# Altium project X98_CARRIER_V1R2.PrjPcb (part 1 of 3)
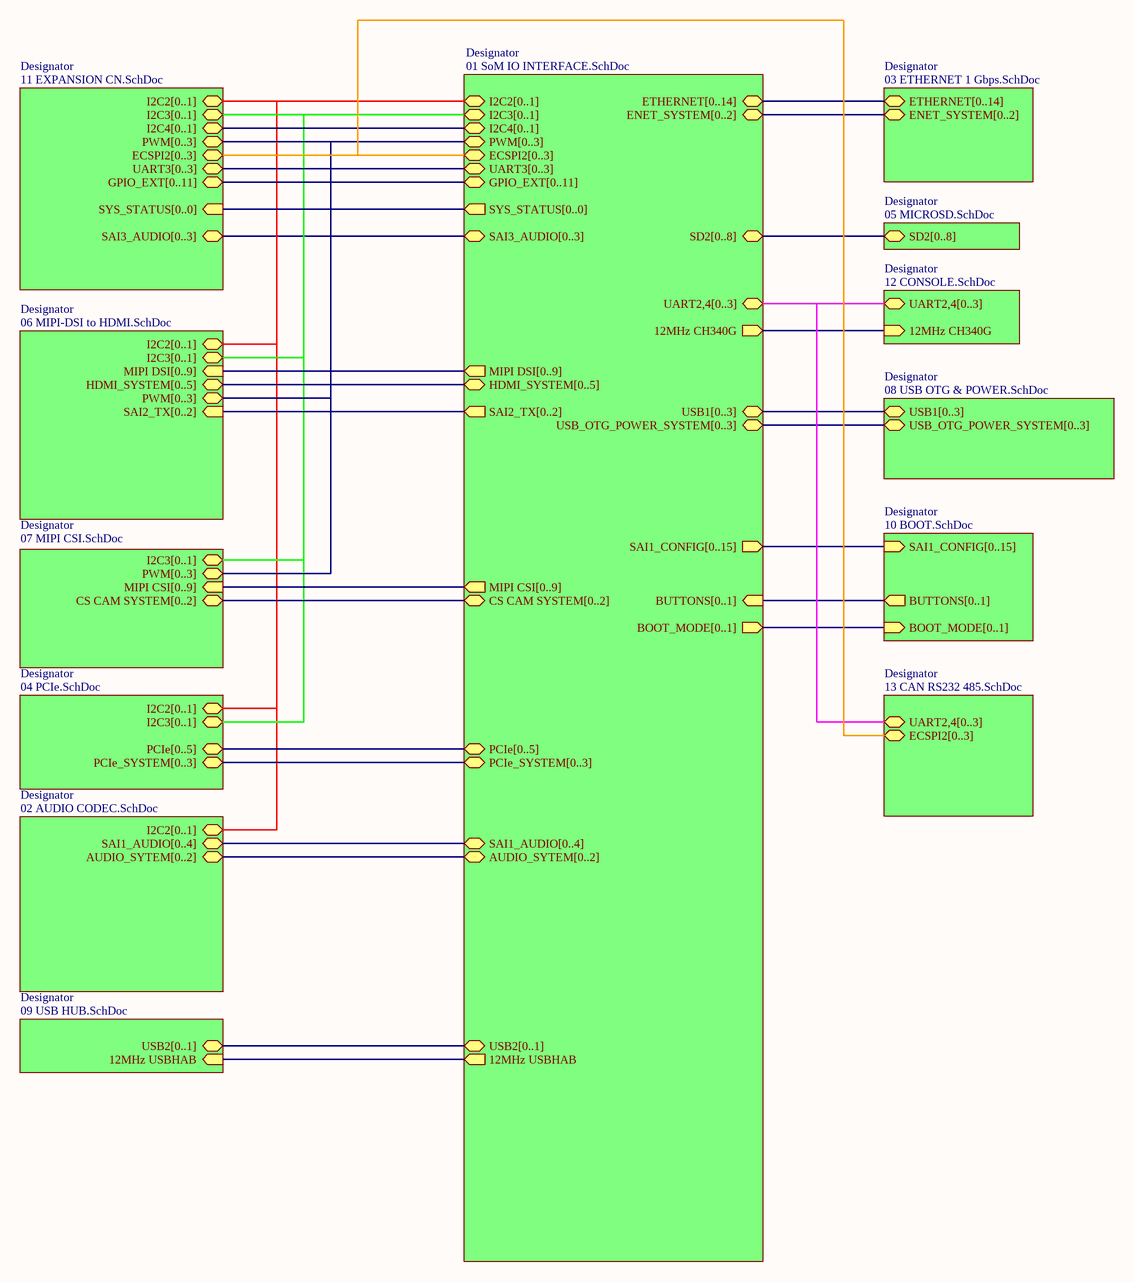
[diagram p0: MAIN.SchDoc]
15 sheets, 356 parts. Net scope: global (net labels, ports and power ports of the same name join across sheets).
Board file: X98_CARRIER_V1R2_12082022.PcbDoc
Sheets:
  MAIN.SchDoc
    Designator = 01 SoM IO INTERFACE.SchDoc
    Designator = 07 MIPI CSI.SchDoc
    Designator = 02 AUDIO CODEC.SchDoc
    Designator = 09 USB HUB.SchDoc
    Designator = 11 EXPANSION CN.SchDoc
    Designator = 04 PCIe.SchDoc
    Designator = 08 USB OTG & POWER.SchDoc
    Designator = 10 BOOT.SchDoc
    Designator = 05 MICROSD.SchDoc
    Designator = 06 MIPI-DSI to HDMI.SchDoc
    Designator = 03 ETHERNET 1 Gbps.SchDoc
    Designator = 12 CONSOLE.SchDoc
    Designator = 13 CAN RS232 485.SchDoc
  00 PCB SPEC.SchDoc

## Sheet MAIN.SchDoc
size A3

### Sub-sheets
Designator = 01 SoM IO INTERFACE.SchDoc: 12MHz USBHAB (out), UART2,4[0..3] (bidir), SD2[0..8] (bidir), ETHERNET[0..14] (bidir), USB2[0..1] (bidir), MIPI DSI[0..9] (out), SAI2_TX[0..2] (out), SAI1_AUDIO[0..4] (bidir), GPIO_EXT[0..11] (bidir), MIPI CSI[0..9] (out), ECSPI2[0..3] (bidir), PCIe_SYSTEM[0..3] (bidir), PCIe[0..5] (bidir), UART3[0..3] (bidir), 12MHz CH340G (out), USB1[0..3] (bidir), SAI1_CONFIG[0..15] (out), AUDIO_SYTEM[0..2] (bidir), HDMI_SYSTEM[0..5] (bidir), CS CAM SYSTEM[0..2] (bidir), ENET_SYSTEM[0..2] (bidir), USB_OTG_POWER_SYSTEM[0..3] (bidir), I2C4[0..1] (bidir), I2C2[0..1] (bidir), I2C3[0..1] (bidir), BUTTONS[0..1] (in), SYS_STATUS[0..0] (out), BOOT_MODE[0..1] (out), SAI3_AUDIO[0..3] (bidir), PWM[0..3] (bidir)
Designator = 07 MIPI CSI.SchDoc: MIPI CSI[0..9] (in), I2C3[0..1] (bidir), CS CAM SYSTEM[0..2] (bidir), PWM[0..3] (bidir)
Designator = 02 AUDIO CODEC.SchDoc: I2C2[0..1] (bidir), SAI1_AUDIO[0..4] (bidir), AUDIO_SYTEM[0..2] (bidir)
Designator = 09 USB HUB.SchDoc: USB2[0..1] (bidir), 12MHz USBHAB (in)
Designator = 11 EXPANSION CN.SchDoc: I2C2[0..1] (bidir), I2C4[0..1] (bidir), I2C3[0..1] (bidir), UART3[0..3] (bidir), GPIO_EXT[0..11] (bidir), ECSPI2[0..3] (bidir), SYS_STATUS[0..0] (in), PWM[0..3] (bidir), SAI3_AUDIO[0..3] (bidir)
Designator = 04 PCIe.SchDoc: PCIe[0..5] (bidir), PCIe_SYSTEM[0..3] (bidir), I2C3[0..1] (bidir), I2C2[0..1] (bidir)
Designator = 08 USB OTG & POWER.SchDoc: USB1[0..3] (bidir), USB_OTG_POWER_SYSTEM[0..3] (bidir)
Designator = 10 BOOT.SchDoc: SAI1_CONFIG[0..15] (in), BUTTONS[0..1] (out), BOOT_MODE[0..1] (in)
Designator = 05 MICROSD.SchDoc: SD2[0..8] (bidir)
Designator = 06 MIPI-DSI to HDMI.SchDoc: SAI2_TX[0..2] (in), I2C3[0..1] (bidir), I2C2[0..1] (bidir), MIPI DSI[0..9] (in), HDMI_SYSTEM[0..5] (bidir), PWM[0..3] (bidir)
Designator = 03 ETHERNET 1 Gbps.SchDoc: ETHERNET[0..14] (bidir), ENET_SYSTEM[0..2] (bidir)
Designator = 12 CONSOLE.SchDoc: 12MHz CH340G (in), UART2,4[0..3] (bidir)
Designator = 13 CAN RS232 485.SchDoc: UART2,4[0..3] (bidir), ECSPI2[0..3] (bidir)

### Nets
(unnamed): sheet Designator/12MHz USBHAB, sheet Designator/12MHz USBHAB
(unnamed): sheet Designator/12MHz CH340G, sheet Designator/12MHz CH340G

### Notes on the sheet
- Sheet Title:
- Inventron
- Size:
- Drawn By:
- Revision:
- Project:
- Checked By:
- A4
- Sheet
- of
- Budotek Teknopark
- Dudullu OSB
- Des 2. Cadde No:8/30
- Umraniye / ISTANBUL
- Electronics and Software
- Date:
- Time:
- ©2020 Inventron Electronics and Software. All rights reserved.

## Sheet 01 SoM IO INTERFACE.SchDoc
size A2
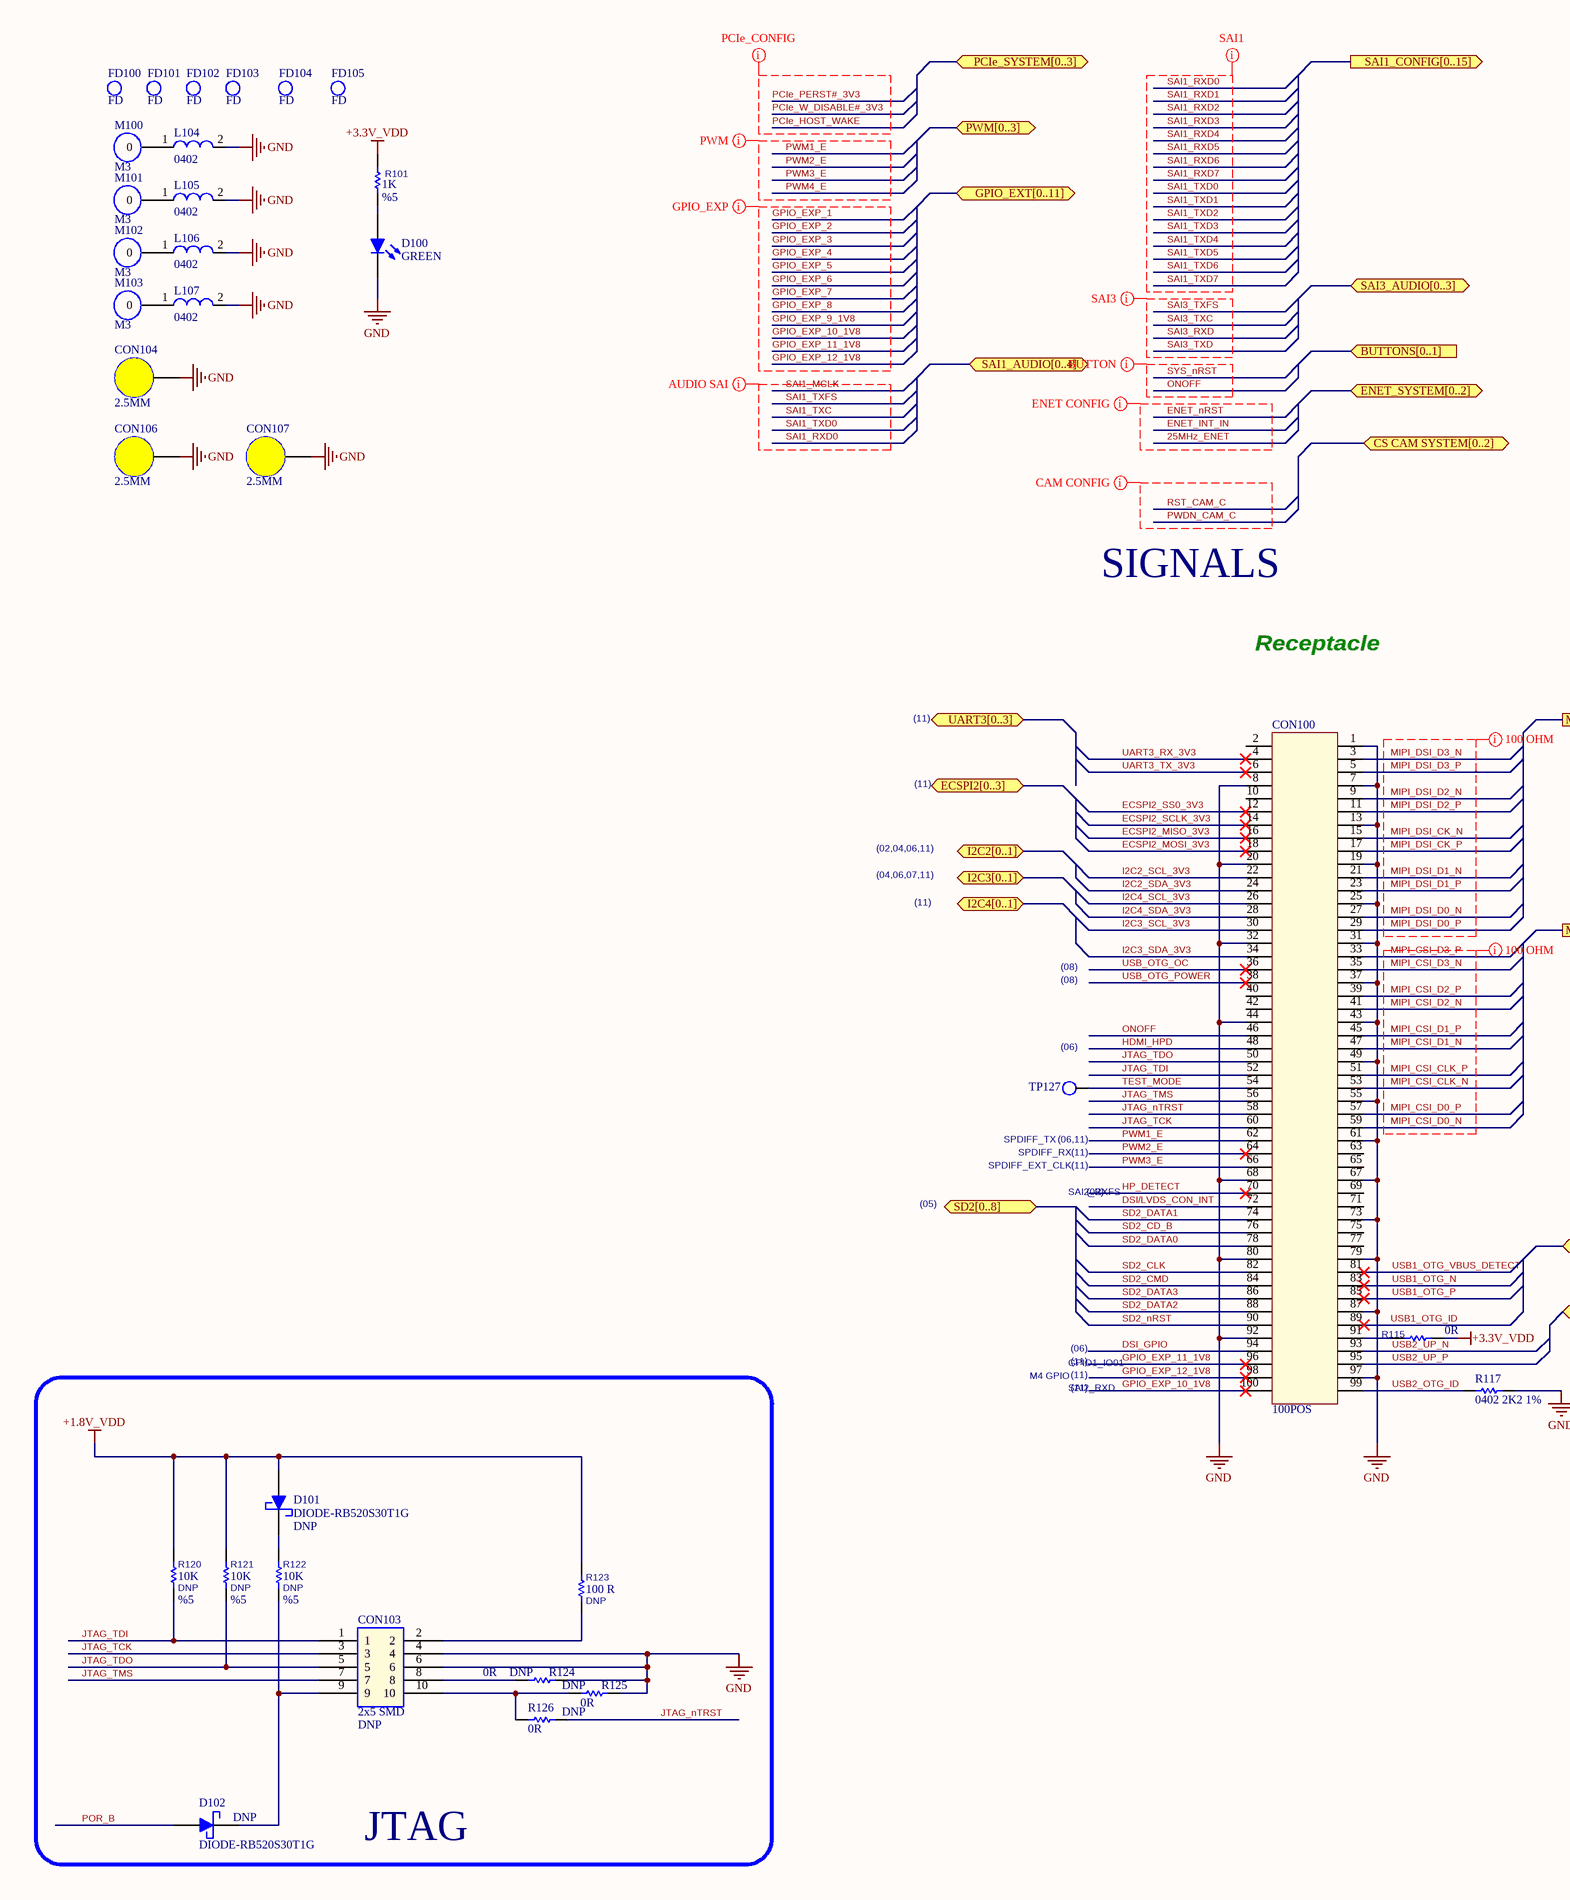
[diagram p1: 01 SoM IO INTERFACE.SchDoc, left]
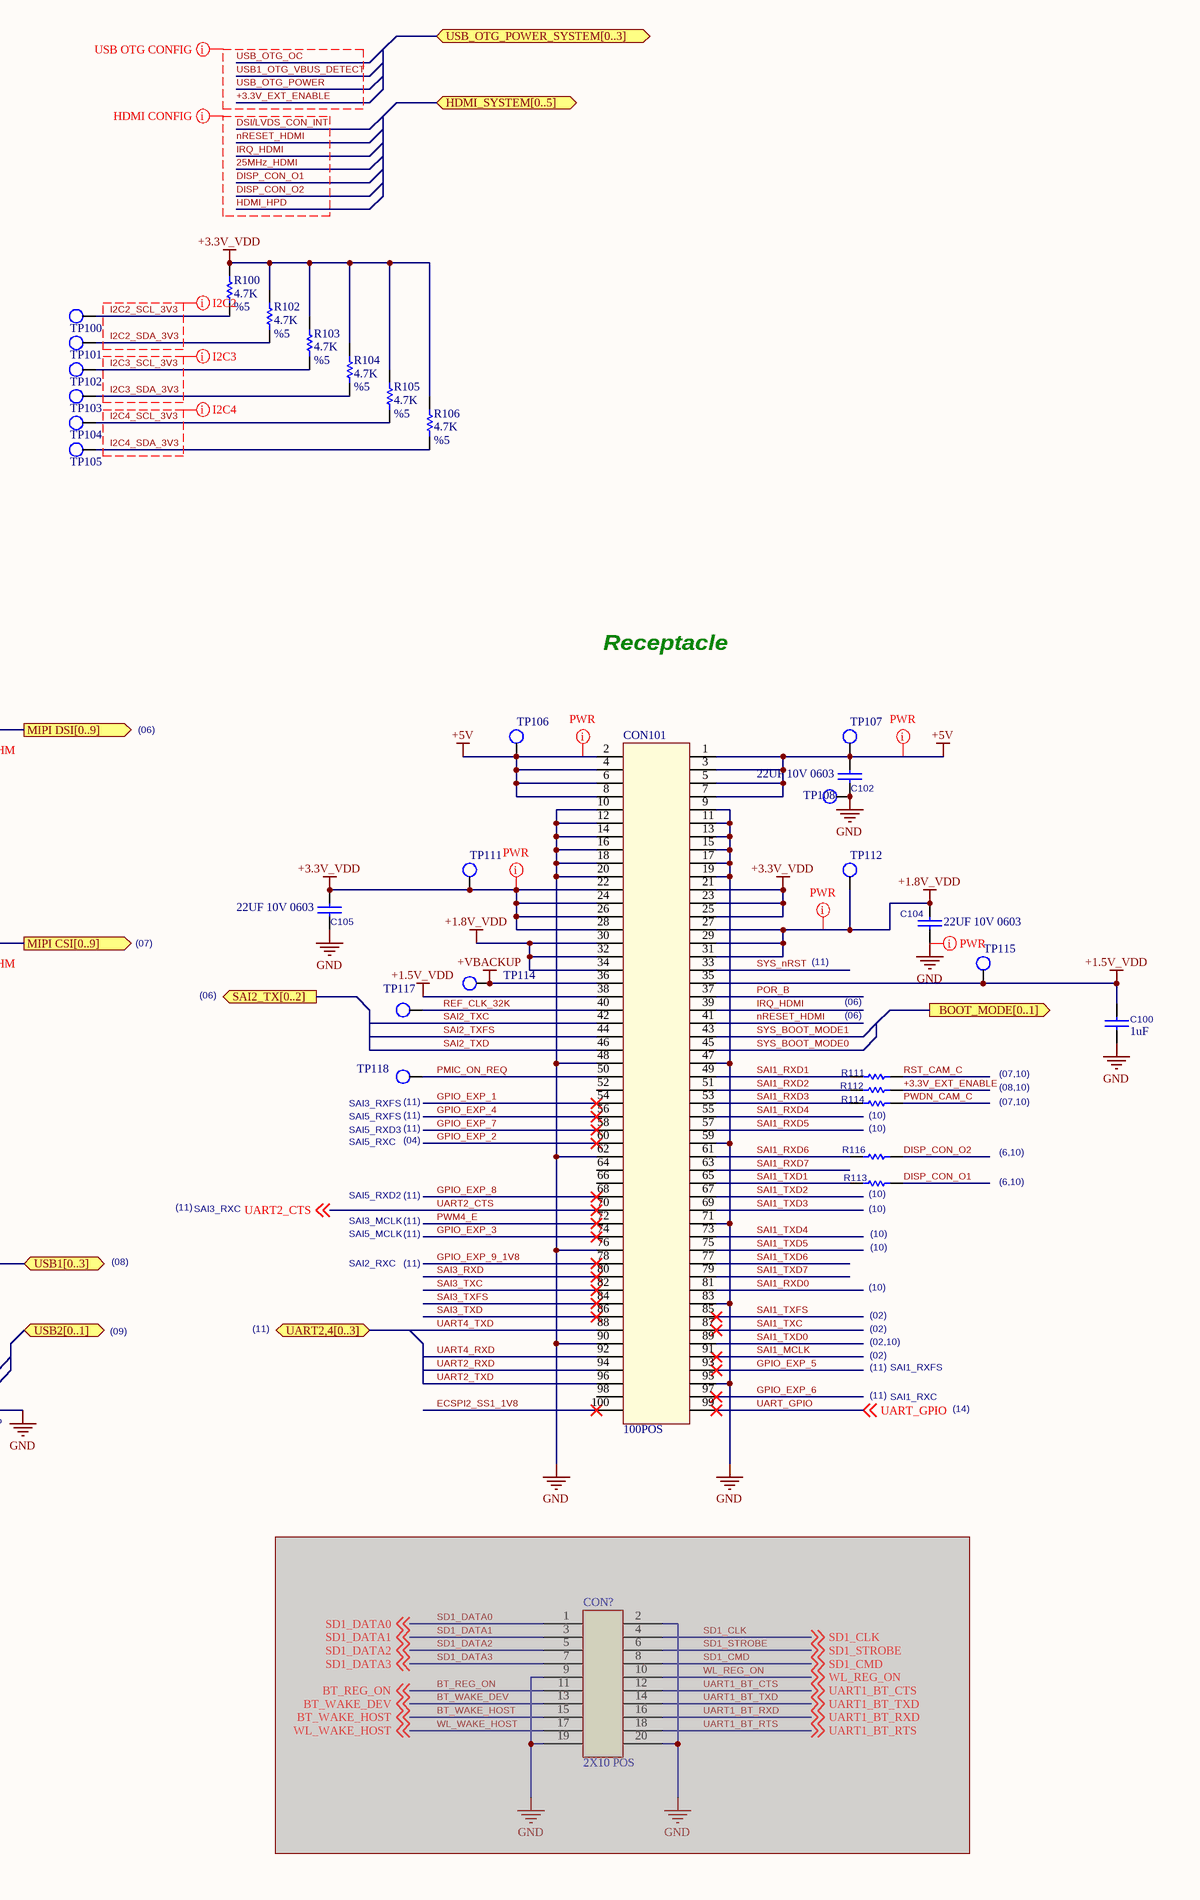
[diagram p2: 01 SoM IO INTERFACE.SchDoc, right]

### Parts
C100  1uF  [0603_CC]
C102  22UF 10V 0603  [0603_CC]
C104  22UF 10V 0603  [0603_CC]
C105  22UF 10V 0603  [0603_CC]
CON100  100POS  [DF40C-100DS- FEMALE]
CON101  100POS  [DF40C-100DS- FEMALE]
CON103  2x5 SMD  ASSY_OPT: DNP  [HEADER 2X5 1.27MM THD]  (no BOM)
CON104  2.5MM  [9774030151R]
CON106  2.5MM  [9774030151R]
CON107  2.5MM  [9774030151R]
CON?  2X10 POS  [DF40C-20DS-0.4V(51)]  (masked out: inside a compile mask, not in the netlist)
D100  GREEN  [0603_LED]
D101  DIODE-RB520S30T1G  ASSY_OPT: DNP  [SOD523]  (no BOM)
D102  DIODE-RB520S30T1G  ASSY_OPT: DNP  [SOD523]  (no BOM)
FD100  FD  [FD]
FD101  FD  [FD]
FD102  FD  [FD]
FD103  FD  [FD]
FD104  FD  [FD]
FD105  FD  [FD]
L104  0402  [0402_RES]
L105  0402  [0402_RES]
L106  0402  [0402_RES]
L107  0402  [0402_RES]
M100  M3  [M3]  (no BOM)
M101  M3  [M3]  (no BOM)
M102  M3  [M3]  (no BOM)
M103  M3  [M3]  (no BOM)
R100  4.7K  Tolerance: %5  [0402_RES]
R101  1K  Tolerance: %5  [0402_RES]
R102  4.7K  Tolerance: %5  [0402_RES]
R103  4.7K  Tolerance: %5  [0402_RES]
R104  4.7K  Tolerance: %5  [0402_RES]
R105  4.7K  Tolerance: %5  [0402_RES]
R106  4.7K  Tolerance: %5  [0402_RES]
R111  0402 330R 5%  [0402_RES]  (value not drawn)
R112  0402 330R 5%  [0402_RES]  (value not drawn)
R113  0402 330R 5%  [0402_RES]  (value not drawn)
R114  0402 330R 5%  [0402_RES]  (value not drawn)
R115  0R  [0402_RES]
R116  0402 330R 5%  [0402_RES]  (value not drawn)
R117  0402 2K2 1%  [0402_RES]
R120  10K  ASSY_OPT: DNP  Tolerance: %5  [0402_RES]  (no BOM)
R121  10K  ASSY_OPT: DNP  Tolerance: %5  [0402_RES]  (no BOM)
R122  10K  ASSY_OPT: DNP  Tolerance: %5  [0402_RES]  (no BOM)
R123  100 R  ASSY_OPT: DNP  [0603_RES]  (no BOM)
R124  0R  ASSY_OPT: DNP  [0402_RES]  (no BOM)
R125  0R  ASSY_OPT: DNP  [0402_RES]  (no BOM)
R126  0R  ASSY_OPT: DNP  [0402_RES]  (no BOM)
TP100  TEST POINT 35  [testpoint_35mil]  (value not drawn)  (no BOM)
TP101  TEST POINT 35  [testpoint_35mil]  (value not drawn)  (no BOM)
TP102  TEST POINT 35  [testpoint_35mil]  (value not drawn)  (no BOM)
TP103  TEST POINT 35  [testpoint_35mil]  (value not drawn)  (no BOM)
TP104  TEST POINT 35  [testpoint_35mil]  (value not drawn)  (no BOM)
TP105  TEST POINT 35  [testpoint_35mil]  (value not drawn)  (no BOM)
TP106  TEST POINT 35  [testpoint_35mil]  (value not drawn)  (no BOM)
TP107  TEST POINT 35  [testpoint_35mil]  (value not drawn)  (no BOM)
TP108  TEST POINT 35  [testpoint_35mil]  (value not drawn)  (no BOM)
TP111  TEST POINT 35  [testpoint_35mil]  (value not drawn)  (no BOM)
TP112  TEST POINT 35  [testpoint_35mil]  (value not drawn)  (no BOM)
TP114  TEST POINT 35  [testpoint_35mil]  (value not drawn)  (no BOM)
TP115  TEST POINT 35  [testpoint_35mil]  (value not drawn)  (no BOM)
TP117  TEST POINT 15  [testpoint_15]  (value not drawn)  (no BOM)
TP118  TEST POINT 15  [testpoint_15]  (value not drawn)  (no BOM)
TP127  TEST POINT 35  [testpoint_35mil]  (value not drawn)  (no BOM)

### Blocks framed on the sheet
JTAG: CON103 D101 D102 R120-R126

### Ports
BOOT_MODE[0..1] (out), BUTTONS[0..1] (in), CS CAM SYSTEM[0..2] (bidir), ECSPI2[0..3] (bidir), ENET_SYSTEM[0..2] (bidir), GPIO_EXT[0..11] (bidir), HDMI_SYSTEM[0..5] (bidir), I2C2[0..1] (bidir), I2C3[0..1] (bidir), I2C4[0..1] (bidir), MIPI CSI[0..9] (out), MIPI DSI[0..9] (out), PCIe_SYSTEM[0..3] (bidir), PWM[0..3] (bidir), SAI1_AUDIO[0..4] (bidir), SAI1_CONFIG[0..15] (out), SAI2_TX[0..2] (out), SAI3_AUDIO[0..3] (bidir), SD2[0..8] (bidir), UART2,4[0..3] (bidir), UART3[0..3] (bidir), USB1[0..3] (bidir), USB2[0..1] (bidir), USB_OTG_POWER_SYSTEM[0..3] (bidir)

### Nets
+1.5V_VDD: C100.2 CON101.35(P35) CON101.38(P38) TP115.1
+1.8V_VDD: C104.1 CON101.27(P27) CON101.29(P29) CON101.30(P30) CON101.31(P31) CON101.32(P32) CON101.34(P34) D101.1(A) R120.2 R121.2 R123.2 TP112.1
+3.3V_VDD: C105.1 CON101.21(P21) CON101.22(P22) CON101.23(P23) CON101.24(P24) CON101.25(P25) CON101.26(P26) CON101.28(P28) R100.2 R101.1 R102.2 R103.2 R104.2 R105.2 R106.2 R115.1 TP111.1
+5V: C102.1 CON101.1(P1) CON101.2(P2) CON101.3(P3) CON101.4(P4) CON101.5(P5) CON101.6(P6) CON101.7(P7) CON101.8(P8) TP106.1 TP107.1
+VBACKUP: CON101.36(P36) TP114.1
GND: C100.1 C102.2 C104.2 C105.2 CON100.1(P1) CON100.7(P7) CON100.8(P8) CON100.13(P13) CON100.19(P19) CON100.20(P20) CON100.25(P25) CON100.31(P31) CON100.32(P32) CON100.37(P37) CON100.43(P43) CON100.44(P44) CON100.49(P49) CON100.55(P55) CON100.61(P61) CON100.67(P67) CON100.68(P68) CON100.73(P73) CON100.79(P79) CON100.80(P80) CON100.87(P87) CON100.92(P92) CON100.97(P97) CON101.9(P9) CON101.10(P10) CON101.11(P11) CON101.12(P12) CON101.13(P13) CON101.14(P14) CON101.15(P15) CON101.16(P16) CON101.17(P17) CON101.18(P18) CON101.19(P19) CON101.20(P20) CON101.47(P47) CON101.48(P48) CON101.59(P59) CON101.62(P62) CON101.71(P71) CON101.76(P76) CON101.83(P83) CON101.90(P90) CON101.95(P95) CON103.4 CON103.6 CON104.0 CON106.0 CON107.0 D100.2(K) L104.2 L105.2 L106.2 L107.2 R117.2 R124.2 R125.2 TP108.1
+3.3V_EXT_ENABLE: R112.2
DISP_CON_O1: R113.1
DISP_CON_O2: R116.1
DSI/LVDS_CON_INT: CON100.72(P72)
DSI_GPIO: CON100.94(P94)
ECSPI2_MISO_3V3: CON100.16(P16)
ECSPI2_MOSI_3V3: CON100.18(P18)
ECSPI2_SCLK_3V3: CON100.14(P14)
ECSPI2_SS0_3V3: CON100.12(P12)
ECSPI2_SS1_1V8: CON101.100(P100)
GPIO_EXP_1: CON101.54(P54)
GPIO_EXP_2: CON101.60(P60)
GPIO_EXP_3: CON101.74(P74)
GPIO_EXP_4: CON101.56(P56)
GPIO_EXP_5: CON101.93(P93)
GPIO_EXP_6: CON101.97(P97)
GPIO_EXP_7: CON101.58(P58)
GPIO_EXP_8: CON101.68(P68)
GPIO_EXP_9_1V8: CON101.78(P78)
GPIO_EXP_10_1V8: CON100.100(P100)
GPIO_EXP_11_1V8: CON100.96(P96)
GPIO_EXP_12_1V8: CON100.98(P98)
HDMI_HPD: CON100.48(P48)
HP_DETECT: CON100.70(P70)
I2C2_SCL_3V3: CON100.22(P22) R100.1 TP100.1
I2C2_SDA_3V3: CON100.24(P24) R102.1 TP101.1
I2C3_SCL_3V3: CON100.30(P30) R103.1 TP102.1
I2C3_SDA_3V3: CON100.34(P34) R104.1 TP103.1
I2C4_SCL_3V3: CON100.26(P26) R105.1 TP104.1
I2C4_SDA_3V3: CON100.28(P28) R106.1 TP105.1
IRQ_HDMI: CON101.39(P39)
JTAG_nTRST: CON100.58(P58) R126.2
JTAG_TCK: CON100.60(P60) CON103.3
JTAG_TDI: CON100.52(P52) CON103.1 R120.1
JTAG_TDO: CON100.50(P50) CON103.5 R121.1
JTAG_TMS: CON100.56(P56) CON103.7
MIPI_CSI_CLK_N: CON100.53(P53)
MIPI_CSI_CLK_P: CON100.51(P51)
MIPI_CSI_D0_N: CON100.59(P59)
MIPI_CSI_D0_P: CON100.57(P57)
MIPI_CSI_D1_N: CON100.47(P47)
MIPI_CSI_D1_P: CON100.45(P45)
MIPI_CSI_D2_N: CON100.41(P41)
MIPI_CSI_D2_P: CON100.39(P39)
MIPI_CSI_D3_N: CON100.35(P35)
MIPI_CSI_D3_P: CON100.33(P33)
MIPI_DSI_CK_N: CON100.15(P15)
MIPI_DSI_CK_P: CON100.17(P17)
MIPI_DSI_D0_N: CON100.27(P27)
MIPI_DSI_D0_P: CON100.29(P29)
MIPI_DSI_D1_N: CON100.21(P21)
MIPI_DSI_D1_P: CON100.23(P23)
MIPI_DSI_D2_N: CON100.9(P9)
MIPI_DSI_D2_P: CON100.11(P11)
MIPI_DSI_D3_N: CON100.3(P3)
MIPI_DSI_D3_P: CON100.5(P5)
nRESET_HDMI: CON101.41(P41)
ONOFF: CON100.46(P46)
PMIC_ON_REQ: CON101.50(P50) TP118.1
POR_B: CON101.37(P37) D102.1(A)
PWDN_CAM_C: R114.2
PWM1_E: CON100.62(P62)
PWM2_E: CON100.64(P64)
PWM3_E: CON100.66(P66)
PWM4_E: CON101.72(P72)
REF_CLK_32K: CON101.40(P40) TP117.1
RST_CAM_C: R111.2
SAI1_MCLK: CON101.91(P91)
SAI1_RXD0: CON101.81(P81)
SAI1_RXD1: CON101.49(P49) R111.1
SAI1_RXD2: CON101.51(P51) R112.1
SAI1_RXD3: CON101.53(P53) R114.1
SAI1_RXD4: CON101.55(P55)
SAI1_RXD5: CON101.57(P57)
SAI1_RXD6: CON101.61(P61) R116.2
SAI1_RXD7: CON101.63(P63)
SAI1_TXC: CON101.87(P87)
SAI1_TXD0: CON101.89(P89)
SAI1_TXD1: CON101.65(P65) R113.2
SAI1_TXD2: CON101.67(P67)
SAI1_TXD3: CON101.69(P69)
SAI1_TXD4: CON101.73(P73)
SAI1_TXD5: CON101.75(P75)
SAI1_TXD6: CON101.77(P77)
SAI1_TXD7: CON101.79(P79)
SAI1_TXFS: CON101.85(P85)
SAI2_TXC: CON101.42(P42)
SAI2_TXD: CON101.46(P46)
SAI2_TXFS: CON101.44(P44)
SAI3_RXD: CON101.80(P80)
SAI3_TXC: CON101.82(P82)
SAI3_TXD: CON101.86(P86)
SAI3_TXFS: CON101.84(P84)
SD2_CD_B: CON100.76(P76)
SD2_CLK: CON100.82(P82)
SD2_CMD: CON100.84(P84)
SD2_DATA0: CON100.78(P78)
SD2_DATA1: CON100.74(P74)
SD2_DATA2: CON100.88(P88)
SD2_DATA3: CON100.86(P86)
SD2_nRST: CON100.90(P90)
SYS_BOOT_MODE0: CON101.45(P45)
SYS_BOOT_MODE1: CON101.43(P43)
SYS_nRST: CON101.33(P33)
TEST_MODE: CON100.54(P54) TP127.1
UART2_CTS: CON101.70(P70) ; off-sheet UART2_CTS
UART2_RXD: CON101.94(P94)
UART2_TXD: CON101.96(P96)
UART3_RX_3V3: CON100.4(P4)
UART3_TX_3V3: CON100.6(P6)
UART4_RXD: CON101.92(P92)
UART4_TXD: CON101.88(P88)
UART_GPIO: CON101.99(P99) ; off-sheet UART_GPIO
USB1_OTG_ID: CON100.89(P89)
USB1_OTG_N: CON100.83(P83)
USB1_OTG_P: CON100.85(P85)
USB1_OTG_VBUS_DETECT: CON100.81(P81)
USB2_OTG_ID: CON100.99(P99) R117.1
USB2_UP_N: CON100.93(P93)
USB2_UP_P: CON100.95(P95)
USB_OTG_OC: CON100.36(P36)
USB_OTG_POWER: CON100.38(P38)
NetCON100_91: CON100.91(P91) R115.2
NetCON103_2: CON103.2 R123.1
NetCON103_8: CON103.8 R124.1
NetCON103_9: CON103.9 D102.2(K) R122.1
NetCON103_10: CON103.10 R125.1 R126.1
NetD100_1: D100.1(A) R101.2
NetD101_2: D101.2(K) R122.2
NetL104_1: L104.1 M100.0
NetL105_1: L105.1 M101.0
NetL106_1: L106.1 M102.0
NetL107_1: L107.1 M103.0

Not connected (* = marked no-connect by the designer): CON100 2(P2) 10(P10) 40(P40) 42(P42) 63(P63) 65(P65) 69(P69) 71(P71) 75(P75) 77(P77); CON101 52(P52) 64(P64) 66(P66) 98(P98)

### Layout directives
differential pair; differential pair class DIFF DSI 100 OHM; net class MIPI DSI: MIPI_DSI_CK_N, MIPI_DSI_CK_P, MIPI_DSI_D0_N, MIPI_DSI_D0_P, MIPI_DSI_D1_N, MIPI_DSI_D1_P, MIPI_DSI_D2_N, MIPI_DSI_D2_P, MIPI_DSI_D3_N, MIPI_DSI_D3_P
differential pair; differential pair class DIFF CSI 100 OHM; net class MIPI CSI: MIPI_CSI_CLK_N, MIPI_CSI_CLK_P, MIPI_CSI_D0_N, MIPI_CSI_D0_P, MIPI_CSI_D1_N, MIPI_CSI_D1_P, MIPI_CSI_D2_N, MIPI_CSI_D2_P, MIPI_CSI_D3_N, MIPI_CSI_D3_P
net class SAI1: SAI1_RXD0, SAI1_RXD1, SAI1_RXD2, SAI1_RXD3, SAI1_RXD4, SAI1_RXD5, SAI1_RXD6, SAI1_RXD7, SAI1_TXD0, SAI1_TXD1, SAI1_TXD2, SAI1_TXD3, SAI1_TXD4, SAI1_TXD5, SAI1_TXD6, SAI1_TXD7
net class PCIe CONFIG: PCIe_HOST_WAKE, PCIe_PERST#_3V3, PCIe_W_DISABLE#_3V3
net class PWM: PWM1_E, PWM2_E, PWM3_E, PWM4_E
net class GPIO_EXP: GPIO_EXP_1, GPIO_EXP_2, GPIO_EXP_3, GPIO_EXP_4, GPIO_EXP_5, GPIO_EXP_6, GPIO_EXP_7, GPIO_EXP_8, GPIO_EXP_9_1V8, GPIO_EXP_10_1V8, GPIO_EXP_11_1V8, GPIO_EXP_12_1V8
net class AUDIO SAI: SAI1_MCLK, SAI1_RXD0, SAI1_TXC, SAI1_TXD0, SAI1_TXFS
net class CAM CONFIG: PWDN_CAM_C, RST_CAM_C
net class ENET CONFIG: 25MHz_ENET, ENET_INT_IN, ENET_nRST
net class SAI3: SAI3_RXD, SAI3_TXC, SAI3_TXD, SAI3_TXFS
net class BUTTON: ONOFF, SYS_nRST
net class HDMI CONFIG: 25MHz_HDMI, DISP_CON_O1, DISP_CON_O2, DSI/LVDS_CON_INT, HDMI_HPD, IRQ_HDMI, nRESET_HDMI
net class USB OTG CONFIG: +3.3V_EXT_ENABLE, USB1_OTG_VBUS_DETECT, USB_OTG_OC, USB_OTG_POWER
net class I2C2: I2C2_SCL_3V3, I2C2_SDA_3V3
net class I2C3: I2C3_SCL_3V3, I2C3_SDA_3V3
net class I2C4: I2C4_SCL_3V3, I2C4_SDA_3V3
net class PWR: +1.8V_VDD, +3.3V_VDD, +5V, GND

### Notes on the sheet
- 01
- SIGNALS
- Receptacle
- (11)
- (06)
- (02,04,06,11)
- (04,06,07,11)
- (07)
- (08)
- (near TP115) (03)
- (near TP127) (06)
- (08,10)
- (07,10)
- SPDIFF_TX
- (near TP127) (06,11)
- (near TP118) SAI5_RXD3
- (near TP118) SAI3_RXFS
- (near TP118) SAI5_RXFS
- SAI5_RXC
- (near TP118) (11)
- (04)
- (near R114) (10)
- (10)
- (6,10)
- (05)
- SPDIFF_EXT_CLK
- SPDIFF_RX
- SAI2_RXFS
- (02)
- SAI3_RXC
- SAI3_MCLK
- SAI5_RXD2
- (near R113) (10)
- 04
- SAI2_RXC
- SAI5_MCLK
- (09)
- (02,10)
- M4 GPIO
- SAI2_RXD
- GPIO1_IO01
- SAI1_RXFS
- SAI1_RXC
- (14)
- Sheet Title:
- Project:
- Inventron
- Electronics and Software
- Size:
- Date:
- Drawn By:
- Revision:
- Checked By:
- A4
- Sheet
- Time:
- of
- Budotek Teknopark
- Dudullu OSB
- Des 2. Cadde No:8/30
- ©2020 Inventron Electronics and Software. All rights reserved.
- Umraniye / ISTANBUL

### Library data of the parts
C100 = CAP-CL10B105KA8NNNC: CAP CER 1UF 25V X7R 0603; Manufacturer-1: SAMSUNG; Class: Capacitor; Manufacturer Part Number-1: CL10B105KA8NNNC; Footprint: *; Manufacturer-2: *; Manufacturer Part Number-2: *; Inventron Stock No: *; Created By: LA; Created Date: *; Checked By: *; ASSY_OPT: *; Dimensions: *; Unit Price: *; Revision Date/Note: *; Price Break: *; Opt. Temp.: *; Features: *
C102 C104 C105 = CAP-C1608X5R1A226M080AC: ±20% 10V Ceramic Capacitor X5R 0603 (1608 Metric); Manufacturer-1: Murata Electronics; Manufacturer Part Number-1: C1608X5R1A226M080AC; Footprint: 0603; Manufacturer-2: *; Manufacturer Part Number-2: *; Inventron Stock No: *; Created By: E.E; Created Date: 2.11.2020; Checked By: *; ASSY_OPT: *; Dimensions: *; Unit Price: *; Revision Date/Note: *; Price Break: *; Opt. Temp.: *; Class: Capacitor; Features: *
CON100 CON101 = CON-DF40C-100DS-0.4V(51): CONN HDR 100POS 0.4MM SMD GOLD; Manufacturer-1: HIROSE; Class: Connector; Manufacturer Part Number-1: DF40C-100DS-0.4V(51); Footprint: 100POS 0.4MM; Manufacturer-2: *; Manufacturer Part Number-2: *; Inventron Stock No: *; Created By: EE; Created Date: 18.11.2020; Checked By: *; ASSY_OPT: *; Dimensions: *; Unit Price: 0.85; Revision Date/Note: *; Price Break: 5K
CON103 = CON-10 PIN 2.54MM TH: 10 PIN 1.27 SMD; Class: Connector; Manufacturer Part Number-1: *; Footprint: *; Manufacturer-1: *; Manufacturer-2: *; Manufacturer Part Number-2: *; Inventron Stock No: *; Created By: *; Created Date: *; Checked By: *; Dimensions: *; Unit Price: *; Revision Date/Note: *; Price Break: *; Opt. Temp.: *
CON104 CON106 CON107 = CON-9774030151R: RND STANDOFF M2X0.4 STEEL 2.5MM; Manufacturer-1: Würth Elektronik; Class: Connector; Manufacturer Part Number-1: 9774030151R; Footprint: *; Manufacturer-2: *; Manufacturer Part Number-2: *; Inventron Stock No: *; Created By: *; Created Date: *; Checked By: *; ASSY_OPT: *; Dimensions: *; Unit Price: 0.7; Revision Date/Note: *; Price Break: 700; Opt. Temp.: *; Features: *
CON? = CON-DF40C-20DS-0.4V(51): CONN RCPT 20POS SMD GOLD; Manufacturer-1: Hirose Electric Co Ltd; Class: Connector; Manufacturer Part Number-1: DF40C-20DS-0.4V(51); Footprint: 2X10; Manufacturer-2: *; Manufacturer Part Number-2: *; Inventron Stock No: *; Created By: E.E; Created Date: 8.10.2020; Checked By: *; ASSY_OPT: *; Dimensions: *; Unit Price: 0.27550; Revision Date/Note: *; Price Break: 5000; Opt. Temp.: *; Features: *
D100 = LED-LTST-C190KRKT: LED SMD 0603 SUPER GREEN; Manufacturer-1: LITEON; Manufacturer Part Number-1: LTST-C190KRKT; Footprint: *; Manufacturer-2: *; Manufacturer Part Number-2: *; Inventron Stock No: *; Created By: *; Created Date: *; Checked By: *; ASSY_OPT: *; Dimensions: *; Unit Price: 0.03343; Revision Date/Note: *; Price Break: 4000; Opt. Temp.: *; Class: Led; Features: *
D101 D102 = DIODE-RB520S30T1G: DIODE SCHOTTKY 30V 200MA SOD523; Manufacturer-1: ON SEMI; Opt. Temp.: -55/+150; Manufacturer Part Number-1: RB520S30T1G; Footprint: SOD-523; Manufacturer-2: *; Manufacturer Part Number-2: *; Inventron Stock No: *; Created By: LA; Created Date: 23.11.2018; Checked By: *; Dimensions: *; Unit Price: 0,0324; Revision Date/Note: *; Price Break: 3K; Class: Diode
FD100-FD105 = FD: Manufacturer Part Number-1: "; Footprint: "; Manufacturer-1: "; Manufacturer-2: *; Manufacturer Part Number-2: *; Inventron Stock No: *; Created By: "; Created Date: "; Checked By: *; ASSY_OPT: *; Dimensions: *; Unit Price: "; Revision Date/Note: *; Price Break: "; Opt. Temp.: "; Class: "
L104-L107 = IND-FERRITE (RES 0 OHM) 0402: 0OHM 0402; Manufacturer Part Number-1: RMCF0402ZT0R00; Manufacturer-1: Stackpole Electronics Inc; Class: Inductor; Footprint: 0402; Manufacturer-2: *; Inventron Stock No: *; Created By: EE; Checked By: *; ASSY_OPT: *; Dimensions: *; Unit Price: 0.00186; Revision Date/Note: *; Price Break: 1000
M100-M103 = CON-M3 SCREW: M3 SCREW
R100 R102-R106 = RES-4.7K: RES 4.7K OHM 5% 1/16W 0402; Manufacturer Part Number-1: RC0402JR-074K7L; Manufacturer-1: Yageo; Opt. Temp.: -55/+155; Class: Resistor; Footprint: 0402; Manufacturer-2: *; Manufacturer Part Number-2: *; Inventron Stock No: *; Created By: LA; Checked By: *; ASSY_OPT: *; Dimensions: *; Revision Date/Note: *
R101 = RES-RMCF0402JT1K00: RES 1K OHM 5% 1/16W 0402; Manufacturer-1: STACKPOLE; Opt. Temp.: -55/+155; Class: Resistor; Manufacturer Part Number-1: RMCF0402JT1K00; Footprint: 0402; Manufacturer-2: *; Manufacturer Part Number-2: *; Inventron Stock No: *; Created By: LA; Created Date: 23.11.2018; Checked By: *; ASSY_OPT: *; Dimensions: *; Unit Price: 0,00127; Revision Date/Note: *; Price Break: 10K
R111-R114 R116 = RES-CRGCQ0402J330R: 330 ±5% 0.063W, 1/16W Chip Resistor 0402 (1005 Metric) Automotive AEC-Q200, Moisture Resistant Thick Film; Manufacturer-1: TE Connectivity Passive Product; Opt. Temp.: -55°C ~ 155°C; Tolerance: %5; Manufacturer Part Number-1: CRGCQ0402J330R; Footprint: 0402; Manufacturer-2: *; Manufacturer Part Number-2: *; Inventron Stock No: *; Created By: E.E; Created Date: 23.10.2020; Checked By: *; ASSY_OPT: *; Dimensions: *; Unit Price: *; Revision Date/Note: *; Price Break: *; Class: Resistor
R115 R124-R126 = RES-RMCF0402ZT0R00: RES 0 OHM JUMPER 1/16W 0402; Manufacturer-1: STACKPOLE; Opt. Temp.: -55/+155; Class: Resistor; Manufacturer Part Number-1: RMCF0402ZT0R00; Footprint: 0402; Manufacturer-2: *; Manufacturer Part Number-2: *; Inventron Stock No: *; Created By: LA; Created Date: 23.11.2018; Checked By: *; Dimensions: *; Unit Price: 0,00127; Revision Date/Note: *; Price Break: 10K
  R115: ASSY_OPT: *
R117 = RES-CRGCQ0402F2K2: 2.2 ±1% 0.063W, 1/16W Chip Resistor 0402 (1005 Metric) Automotive AEC-Q200, Moisture Resistant Thick Film; Manufacturer-1: TE Connectivity Passive Product; Opt. Temp.: -55°C ~ 155°C; Manufacturer Part Number-1: CRGCQ0402F2K2; Footprint: 0402; Manufacturer-2: *; Manufacturer Part Number-2: *; Inventron Stock No: *; Created By: E.E; Created Date: 22.10.2020; Checked By: *; ASSY_OPT: *; Dimensions: *; Unit Price: *; Revision Date/Note: *; Price Break: *; Class: Resistor; Tolerance: *
R120-R122 = RES-RMCF0402JT10K0: RES 10K OHM 5% 1/16W 0402; Manufacturer-1: STACKPOLE; Opt. Temp.: -55/+155; Class: Resistor; Manufacturer Part Number-1: RMCF0402JT10K0; Footprint: 0402; Manufacturer-2: *; Manufacturer Part Number-2: *; Inventron Stock No: *; Created By: LA; Created Date: 23.11.2018; Checked By: *; Dimensions: *; Unit Price: 0,00127; Revision Date/Note: *; Price Break: 10K
R123 = RES-RMCF0603FT100R: RES 100 OHM %1 1/10W 0603; Manufacturer-1: STACKPOLE; Opt. Temp.: -55/+155; Class: Resistor; Manufacturer Part Number-1: RMCF0603FT100R; Footprint: 0603; Manufacturer-2: *; Manufacturer Part Number-2: *; Inventron Stock No: *; Created By: LA; Created Date: *; Checked By: *; Dimensions: *; Unit Price: *; Revision Date/Note: *; Price Break: *; Features: AUTOMOTIVE; Tolerance: *

## Sheet 07 MIPI CSI.SchDoc
size A4
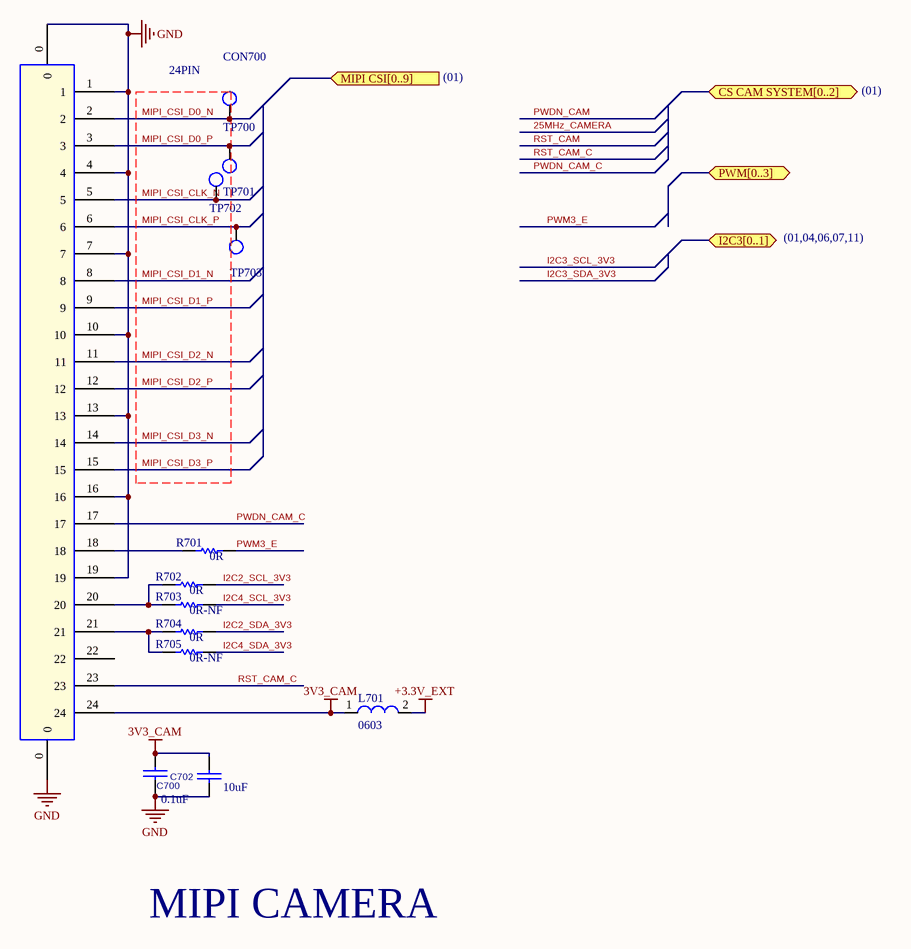
[diagram p3: 07 MIPI CSI.SchDoc]

### Parts
C700  0.1uF  [0402_CC]
C702  10uF  [0603_CC]
CON700  24PIN  [24-PIN FPC]
L701  0603  [0603_RES]
R701  0R  [0402_RES]
R702  0R  [0402_RES]
R703  0R-NF  [0402_RES]  (no BOM)
R704  0R  [0402_RES]
R705  0R-NF  [0402_RES]  (no BOM)
TP700  TEST POINT 15  [testpoint_15]  (value not drawn)  (no BOM)
TP701  TEST POINT 15  [testpoint_15]  (value not drawn)  (no BOM)
TP702  TEST POINT 15  [testpoint_15]  (value not drawn)  (no BOM)
TP703  TEST POINT 15  [testpoint_15]  (value not drawn)  (no BOM)

### Ports
CS CAM SYSTEM[0..2] (bidir), I2C3[0..1] (bidir), MIPI CSI[0..9] (in), PWM[0..3] (bidir)

### Nets
3V3_CAM: C700.1 C702.1 CON700.24 L701.1
+3.3V_EXT: L701.2
GND: C700.2 C702.2 CON700.0 CON700.1 CON700.4 CON700.7 CON700.10 CON700.13 CON700.16 CON700.19
I2C2_SCL_3V3: R702.2
I2C2_SDA_3V3: R704.2
I2C4_SCL_3V3: R703.2
I2C4_SDA_3V3: R705.2
MIPI_CSI_CLK_N: CON700.5 TP702.1
MIPI_CSI_CLK_P: CON700.6 TP703.1
MIPI_CSI_D0_N: CON700.2 TP700.1
MIPI_CSI_D0_P: CON700.3 TP701.1
MIPI_CSI_D1_N: CON700.8
MIPI_CSI_D1_P: CON700.9
MIPI_CSI_D2_N: CON700.11
MIPI_CSI_D2_P: CON700.12
MIPI_CSI_D3_N: CON700.14
MIPI_CSI_D3_P: CON700.15
PWDN_CAM_C: CON700.17
PWM3_E: R701.2
RST_CAM_C: CON700.23
NetCON700_18: CON700.18 R701.1
NetCON700_20: CON700.20 R702.1 R703.1
NetCON700_21: CON700.21 R704.1 R705.1

Not connected (* = marked no-connect by the designer): CON700 22

### Notes on the sheet
- (01)
- (01,04,06,07,11)
- MIPI CAMERA
- Sheet Title:
- Inventron
- Size:
- Drawn By:
- Revision:
- Project:
- Checked By:
- A4
- Sheet
- of
- Budotek Teknopark
- Dudullu OSB
- Des 2. Cadde No:8/30
- Umraniye / ISTANBUL
- Electronics and Software
- Date:
- Time:
- ©2020 Inventron Electronics and Software. All rights reserved.

### Library data of the parts
C700 = CAP-CL05B104KO5NNNC: CAP VER 0.1UF 16V X7R 0402; Manufacturer-1: SAMSUNG; Opt. Temp.: -55/+125; Class: Capacitor; Manufacturer Part Number-1: CL05B104KO5NNNC; Footprint: 0402; Manufacturer-2: *; Manufacturer Part Number-2: *; Inventron Stock No: *; Created By: LA; Created Date: 23.11.2018; Checked By: *; ASSY_OPT: *; Dimensions: *; Unit Price: 0,00499; Revision Date/Note: *; Price Break: 10K
C702 = CAP-JMK107BC6106MA-T: CAP CER 10UF 6.3V X6S 0603; Manufacturer-1: TAIYO YUDEN; Opt. Temp.: -55/+105; Class: Capacitor; Manufacturer Part Number-1: JMK107BC6106MA-T; Footprint: 0603; Manufacturer-2: *; Manufacturer Part Number-2: *; Inventron Stock No: *; Created By: LA; Created Date: 23.11.2018; Checked By: *; ASSY_OPT: *; Dimensions: *; Unit Price: 0,044; Revision Date/Note: *; Price Break: 4K
CON700 = CON-SFV24R-4STBE1HLF(GENIS): CONN FPC TOP 24POS 0.50MM R/A; Manufacturer-1: AMPHENOL; Opt. Temp.: -55/+105; Class: Connector; Manufacturer Part Number-1: SFV24R-4STBE1HLF; Footprint: *; Manufacturer-2: *; Manufacturer Part Number-2: *; Inventron Stock No: *; Created By: LA; Created Date: 06.05.2019; Checked By: *; ASSY_OPT: *; Dimensions: *; Unit Price: 0,19575; Revision Date/Note: *; Price Break: 3K
L701 = IND-FERRITE (RES 0 OHM) 0603: 0OHM 0603; Manufacturer Part Number-1: RC0603JR-070RL; Manufacturer-1: YAGEO; Class: Inductor; Footprint: 0603; Manufacturer-2: *; Inventron Stock No: *; Created By: EE; Checked By: *; ASSY_OPT: *; Dimensions: *; Revision Date/Note: *
R701-R705 = RES-RMCF0402ZT0R00: as R115 on sheet 01 SoM IO INTERFACE; Manufacturer Part Number-1: RMCF0402ZT0R00; Footprint: 0402; Manufacturer-2: *; Manufacturer Part Number-2: *; Inventron Stock No: *; Created By: LA; Created Date: 23.11.2018; Checked By: *; ASSY_OPT: *; Dimensions: *; Unit Price: 0,00127; Revision Date/Note: *; Price Break: 10K

## Sheet 02 AUDIO CODEC.SchDoc
size A3

### Notes on the sheet
- Sheet Title:
- Inventron
- Size:
- Drawn By:
- Revision:
- Project:
- Checked By:
- A4
- Sheet
- of
- Budotek Teknopark
- Dudullu OSB
- Des 2. Cadde No:8/30
- Umraniye / ISTANBUL
- Electronics and Software
- Date:
- Time:
- ©2020 Inventron Electronics and Software. All rights reserved.

## Sheet 09 USB HUB.SchDoc
size A3
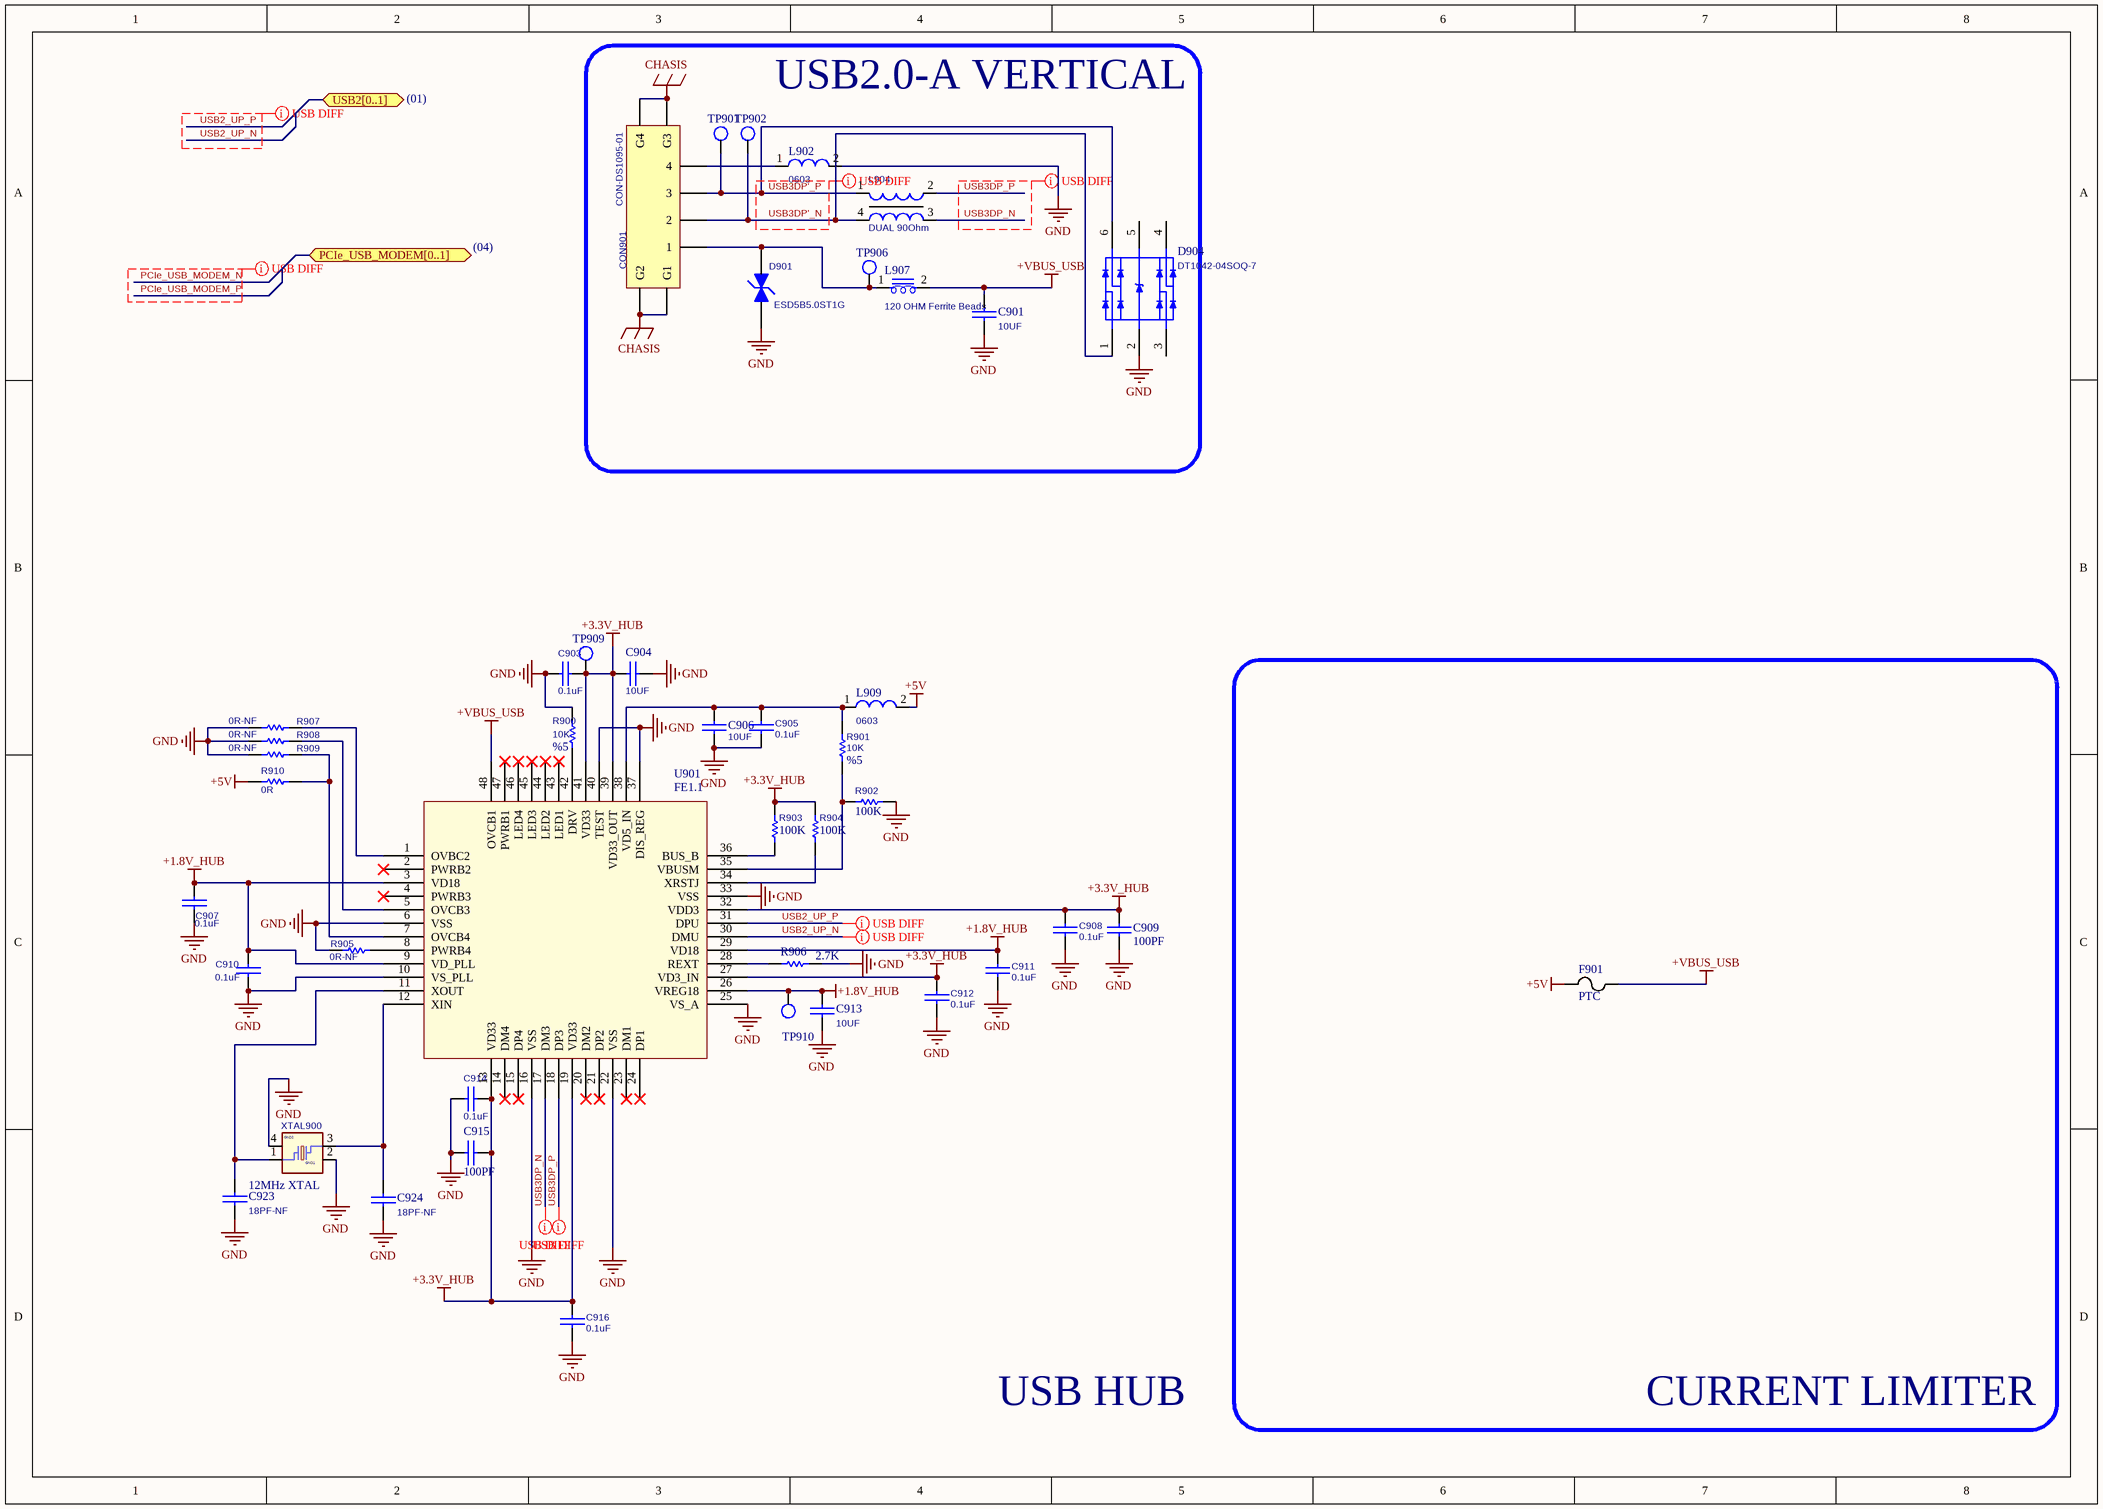
[diagram p4: 09 USB HUB.SchDoc]

### Parts
C901  10UF  [0805]
C903  0.1uF  [0402_CC]
C904  10UF  [0805]
C905  0.1uF  [0402_CC]
C906  10UF  [0805]
C907  0.1uF  [0402_CC]
C908  0.1uF  [0402_CC]
C909  100PF  [0402_CC]
C910  0.1uF  [0402_CC]
C911  0.1uF  [0402_CC]
C912  0.1uF  [0402_CC]
C913  10UF  [0805]
C914  0.1uF  [0402_CC]
C915  100PF  [0402_CC]
C916  0.1uF  [0402_CC]
C923  18PF-NF  [0402_CC]  (no BOM)
C924  18PF-NF  [0402_CC]  (no BOM)
CON901  CON-DS1095-01  [CON-DS1095-01]
D901  ESD5B5.0ST1G  [SOD523 - SZESD]
D904  DT1042-04SOQ-7  [DIODE-DT1042-04SOQ-7]
F901  PTC  [1812]
L902  0603  [0603_RES]
L904  DUAL 90Ohm  [DLW21H]
L907  120 OHM Ferrite Beads  [0603_RES]
L909  0603  [0603_RES]
R900  10K  Tolerance: %5  [0402_RES]
R901  10K  Tolerance: %5  [0402_RES]
R902  100K  [0402_RES]
R903  100K  [0402_RES]
R904  100K  [0402_RES]
R905  0R-NF  [0402_RES]  (no BOM)
R906  2.7K  [0402_RES]
R907  0R-NF  [0402_RES]  (no BOM)
R908  0R-NF  [0402_RES]  (no BOM)
R909  0R-NF  [0402_RES]  (no BOM)
R910  0R  [0402_RES]
TP901  TEST POINT 15  [testpoint_15]  (value not drawn)  (no BOM)
TP902  TEST POINT 15  [testpoint_15]  (value not drawn)  (no BOM)
TP906  TEST POINT 15  [testpoint_15]  (value not drawn)  (no BOM)
TP909  TEST POINT 15  [testpoint_15]  (value not drawn)  (no BOM)
TP910  TEST POINT 15  [testpoint_15]  (value not drawn)  (no BOM)
U901  FE1.1  [LQFP48]
XTAL900  CRYSTAL 12.MHZ 18PF SMD  [XTLOSC4_3P2X2P5MM_SM]  (value not drawn)

### Blocks framed on the sheet
USB2.0-A VERTICAL: C901 CON901 D901 D904 L902 L904 L907 TP901 TP902 TP906
CURRENT LIMITER: F901

### Ports
PCIe_USB_MODEM[0..1] (bidir), USB2[0..1] (bidir)

### Nets
+1.8V_HUB: C907.1 C910.1 C911.2 C913.1 TP910.1 U901.3(VD18) U901.9(VD_PLL) U901.26(VREG18) U901.29(VD18)
+3.3V_HUB: C903.1 C904.1 C908.2 C909.2 C912.2 C914.2 C915.2 C916.2 R903.2 R904.2 TP909.1 U901.13(VD33) U901.19(VD33) U901.27(VD3_IN) U901.32(VDD3) U901.39(VD33_OUT) U901.41(VD33)
+5V: F901.1 L909.2 R910.2
+VBUS_USB: C901.1 F901.2 L907.2 U901.48(OVCB1)
CHASIS: CON901.G1 CON901.G2 CON901.G3 CON901.G4
GND: C901.2 C903.2 C904.2 C905.1 C906.1 C907.2 C908.1 C909.1 C910.2 C911.1 C912.1 C913.2 C914.1 C915.1 C916.1 C923.2 C924.2 D901.1(A) D904.2(VSS) L902.2 R900.1 R902.1 R905.1 R906.2 R907.1 R908.1 R909.1 U901.6(VSS) U901.10(VS_PLL) U901.16(VSS) U901.22(VSS) U901.25(VS_A) U901.33(VSS) U901.37(DIS_REG) U901.40(TEST) XTAL900.2(GND1) XTAL900.4(GND2)
USB2_UP_N: U901.30(DMU)
USB2_UP_P: U901.31(DPU)
USB3DP'_N: CON901.2 D904.1(IO1) L904.4 TP902.1
USB3DP'_P: CON901.3 D904.6(IO4) L904.1 TP901.1
USB3DP_N: L904.3 U901.17(DM3)
USB3DP_P: L904.2 U901.18(DP3)
NetC905_2: C905.2 C906.2 L909.1 R901.2 U901.38(VD5_IN)
NetC923_1: C923.1 U901.11(XOUT) XTAL900.1
NetC924_1: C924.1 U901.12(XIN) XTAL900.3
NetCON901_1: CON901.1 D901.2(K) L907.1 TP906.1
NetCON901_4: CON901.4 L902.1
NetR900_2: R900.2 U901.42(DRV)
NetR901_1: R901.1 R902.2 U901.35(VBUSM)
NetR903_1: R903.1 U901.36(BUS_B)
NetR904_1: R904.1 U901.34(XRSTJ)
NetR905_2: R905.2 U901.8(PWRB4)
NetR906_1: R906.1 U901.28(REXT)
NetR907_2: R907.2 U901.1(OVBC2)
NetR908_2: R908.2 U901.5(OVCB3)
NetR909_2: R909.2 R910.1 U901.7(OVCB4)

Not connected (* = marked no-connect by the designer): D904 3(IO2) 4(IO3) 5(VCC); U901 2(PWRB2)* 4(PWRB3)* 14(DM4)* 15(DP4)* 20(DM2)* 21(DP2)* 23(DM1)* 24(DP1)* 43(LED1)* 44(LED2)* 45(LED3)* 46(LED4)* 47(PWRB1)*

### Layout directives
differential pair; differential pair class USB 90 OHM DIFF; net class USB: PCIe_USB_MODEM_N, PCIe_USB_MODEM_P, USB2_UP_N, USB2_UP_P, USB3DP'_N, USB3DP'_P, USB3DP_N, USB3DP_P
differential pair; differential pair class USB 90 OHM DIFF; net class USB; net class USB: USB3DP_N, USB3DP_P

### Notes on the sheet
- (01)
- (04)
- 12MHz XTAL
- USB HUB
- Sheet Title:
- Inventron
- Size:
- Drawn By:
- Revision:
- Project:
- Checked By:
- A4
- Sheet
- of
- Budotek Teknopark
- Dudullu OSB
- Des 2. Cadde No:8/30
- Umraniye / ISTANBUL
- Electronics and Software
- Date:
- Time:
- ©2020 Inventron Electronics and Software. All rights reserved.

### Library data of the parts
C901 C904 C906 C913 = CAP-CL21A106KOQNNNG: CAP CER 10UF 16V X5R 0805; Manufacturer-1: SAMSUNG; Class: Capacitor; Manufacturer Part Number-1: CL21A106KOQNNNG; Footprint: *; Manufacturer-2: *; Manufacturer Part Number-2: *; Inventron Stock No: *; Created By: EE; Created Date: *; Checked By: *; ASSY_OPT: *; Dimensions: *; Unit Price: 0.01876; Revision Date/Note: *; Price Break: 3000; Opt. Temp.: *; Features: *
C903 C905 C907 C908 C910-C912 C914 C916 = CAP-CL05B104KO5NNNC: as C700 on sheet 07 MIPI CSI; Manufacturer Part Number-1: CL05B104KO5NNNC; Footprint: 0402; Manufacturer-2: *; Manufacturer Part Number-2: *; Inventron Stock No: *; Created By: LA; Created Date: 23.11.2018; Checked By: *; ASSY_OPT: *; Dimensions: *; Unit Price: 0,00499; Revision Date/Note: *; Price Break: 10K
C909 C915 = CAP-CC0402JRNPO9BN101: CAP CER 100PF 50V C0G/NPO 0402; Manufacturer-1: Yageo; Class: Capacitor; Manufacturer Part Number-1: CC0402JRNPO9BN101; Footprint: *; Manufacturer-2: *; Manufacturer Part Number-2: *; Inventron Stock No: *; Created By: *; Created Date: *; Checked By: *; ASSY_OPT: *; Dimensions: *; Unit Price: *; Revision Date/Note: *; Price Break: *; Opt. Temp.: *; Features: *
C923 C924 = CAP-GCM1555C1H180JA16D: CAP CER 18PF 50V C0G/NP0 0402; Manufacturer-1: Murata Electronics; Class: Capacitor; Manufacturer Part Number-1: GCM1555C1H180JA16D; Footprint: *; Manufacturer-2: *; Manufacturer Part Number-2: *; Inventron Stock No: *; Created By: *; Created Date: *; Checked By: *; ASSY_OPT: *; Dimensions: *; Unit Price: *; Revision Date/Note: *; Price Break: *; Opt. Temp.: *; Features: *
CON901 = CON-DS1095-01: CON USB2.0 A TYPE VERTICAL TYPE TH; Manufacturer Part Number-1: DS1095-01-01-WNRQ; Class: Connector; Footprint: *; Manufacturer-1: *; Manufacturer-2: *; Manufacturer Part Number-2: *; Inventron Stock No: *; Created By: LA; Created Date: 29.03.2019; Checked By: *; ASSY_OPT: *; Dimensions: *; Unit Price: *; Revision Date/Note: *; Price Break: *; Opt. Temp.: *
D901 = DIODE-ESD5B5.0ST1G: VS DIODE 5V SOD523; Manufacturer-1: ON Semiconductor; Opt. Temp.: -55/+150; Manufacturer Part Number-1: ESD5B5.0ST1G; Footprint: SOD-523; Manufacturer-2: *; Manufacturer Part Number-2: *; Inventron Stock No: *; Created By: E.E; Created Date: 3.11.2020; Checked By: *; ASSY_OPT: *; Dimensions: *; Unit Price: 0,0129; Revision Date/Note: *; Price Break: 3000; Class: Diode; Features: AUTOMOTIVE
D904 = DIODE-DT1042-04SOQ-7: HDMI TVS DIODE; Manufacturer-1: Diodes Incorporated; Opt. Temp.: -55°C ~ 85°C (TA); Manufacturer Part Number-1: DT1042-04SOQ-7; Footprint: SOT26; Manufacturer-2: *; Manufacturer Part Number-2: *; Inventron Stock No: *; Created By: E.E; Created Date: 23.10.2020; Checked By: *; ASSY_OPT: *; Dimensions: *; Unit Price: 0.07575; Revision Date/Note: *; Price Break: 3000; Class: Diode
F901 = FUSE-KMC5S110RY33: THERMISTOR PTC RESETTABLE FUSE 1206 1100mA 33V 1812; Manufacturer-1: THINKING; Manufacturer Part Number-1: KMC5S110RY33; Manufacturer-2: *; Manufacturer Part Number-2: *; Inventron Stock No: *; Created By: EE; Created Date: *; Checked By: *; ASSY_OPT: *; Dimensions: *; Unit Price: 0.083; Revision Date/Note: *; Price Break: 4000; Opt. Temp.: *; Class: FUSE
L902 L909 = IND-FERRITE (RES 0 OHM) 0603: as L701 on sheet 07 MIPI CSI; Footprint: 0603; Manufacturer-2: *; Inventron Stock No: *; Created By: EE; Checked By: *; ASSY_OPT: *; Dimensions: *; Revision Date/Note: *
L904 = IND-DLW21HN900SQ2L: Common Mode Chokes Dual 90Ohm 100MHz 0.33A 0.35Ohm DCR SMD T/R; Manufacturer-1: Murata Manufacturing; Class: Inductor; Manufacturer Part Number-1: DLW21HN900SQ2L; Footprint: *; Manufacturer-2: *; Manufacturer Part Number-2: *; Inventron Stock No: *; Created By: E.E; Created Date: 2.11.2020; Checked By: *; ASSY_OPT: *; Dimensions: *; Unit Price: 0.185; Revision Date/Note: *; Price Break: 3000; Opt. Temp.: *; Features: *
L907 = IND-BLM18PG121SH1D: Ferrite Beads Multi-Layer 120Ohm 25% 100MHz 2A 0.05Ohm DCR 0603 Automotive T/R; Manufacturer-1: Murata Manufacturing; Class: Inductor; Manufacturer Part Number-1: BLM18PG121SH1D; Footprint: 0603; Manufacturer-2: *; Manufacturer Part Number-2: *; Inventron Stock No: *; Created By: E.E; Created Date: 2.11.2020; Checked By: *; ASSY_OPT: *; Dimensions: *; Unit Price: 0.02550; Revision Date/Note: *; Price Break: 4000; Opt. Temp.: *; Features: *
R900 R901 = RES-RMCF0402JT10K0: as R120 on sheet 01 SoM IO INTERFACE; Manufacturer Part Number-1: RMCF0402JT10K0; Footprint: 0402; Manufacturer-2: *; Manufacturer Part Number-2: *; Inventron Stock No: *; Created By: LA; Created Date: 23.11.2018; Checked By: *; ASSY_OPT: *; Dimensions: *; Unit Price: 0,00127; Revision Date/Note: *; Price Break: 10K
R902-R904 = RES-RMCF0402JT100K: RES 100K OHM 5% 1/16W 0402; Manufacturer-1: STACKPOLE; Opt. Temp.: -55/+155; Class: Resistor; Tolerance: %5; Manufacturer Part Number-1: RMCF0402JT100K; Footprint: 0402; Manufacturer-2: *; Manufacturer Part Number-2: *; Inventron Stock No: *; Created By: LA; Created Date: 23.11.2018; Checked By: *; ASSY_OPT: *; Dimensions: *; Unit Price: 0,00127; Revision Date/Note: *; Price Break: 10K; Features: AUTOMOTIVE
R905 R907-R910 = RES-RMCF0402ZT0R00: as R115 on sheet 01 SoM IO INTERFACE; Manufacturer Part Number-1: RMCF0402ZT0R00; Footprint: 0402; Manufacturer-2: *; Manufacturer Part Number-2: *; Inventron Stock No: *; Created By: LA; Created Date: 23.11.2018; Checked By: *; ASSY_OPT: *; Dimensions: *; Unit Price: 0,00127; Revision Date/Note: *; Price Break: 10K
R906 = RES-RMCF0402FT2K70: RES SMD 2.7K OHM 1% 1/16W 0402; Manufacturer-1: Yageo; Class: Resistor; Manufacturer Part Number-1: RMCF0402FT2K70; Footprint: 0402; Manufacturer-2: *; Manufacturer Part Number-2: *; Inventron Stock No: *; Created By: EE; Created Date: *; Checked By: *; ASSY_OPT: *; Dimensions: *; Unit Price: *; Revision Date/Note: *; Price Break: *; Opt. Temp.: *; Tolerance: *
U901 = IC-FE1.1-AQFP48A: IC 4XCH USB Hub Controller USB 2.0 USB Interface 48-QFP (7x7); Manufacturer-1: TERMINUS; Class: ICs; Manufacturer Part Number-1: FE1.1-AQFP48A; Footprint: 48 LQFP; Manufacturer-2: *; Manufacturer Part Number-2: *; Inventron Stock No: *; Created By: OKS; Created Date: 03.06.2022; Checked By: *; ASSY_OPT: *; Dimensions: *; Unit Price: 1.05; Revision Date/Note: *; Price Break: 5000; Opt. Temp.: *
XTAL900 = XTAL-FA-238V 12.0000MB50X-C0: CRYSTAL 12.0000MHZ 18PF SMD; Manufacturer-1: EPSON; Opt. Temp.: +40/+85; Manufacturer Part Number-1: FA-238V 12.0000MB50X-C0; Footprint: 4-SMD; Manufacturer-2: *; Manufacturer Part Number-2: *; Inventron Stock No: *; Created By: E.E; Created Date: 20.10.2020; Checked By: *; ASSY_OPT: *; Dimensions: *; Unit Price: 0.6; Revision Date/Note: *; Price Break: 1K; Class: Crystal

## Sheet 11 EXPANSION CN.SchDoc
size A3; Organization: Protel International P/L; Address1: L3, 12a Rodborough Rd; Address2: Frenchs Forest; Address3: NSW; Address4: Australia 2086

### Notes on the sheet
- Sheet Title:
- Inventron
- Size:
- Drawn By:
- Revision:
- Project:
- Checked By:
- A4
- Sheet
- of
- Budotek Teknopark
- Dudullu OSB
- Des 2. Cadde No:8/30
- Umraniye / ISTANBUL
- Electronics and Software
- Date:
- Time:
- ©2020 Inventron Electronics and Software. All rights reserved.

## Sheet 04 PCIe.SchDoc
size A3
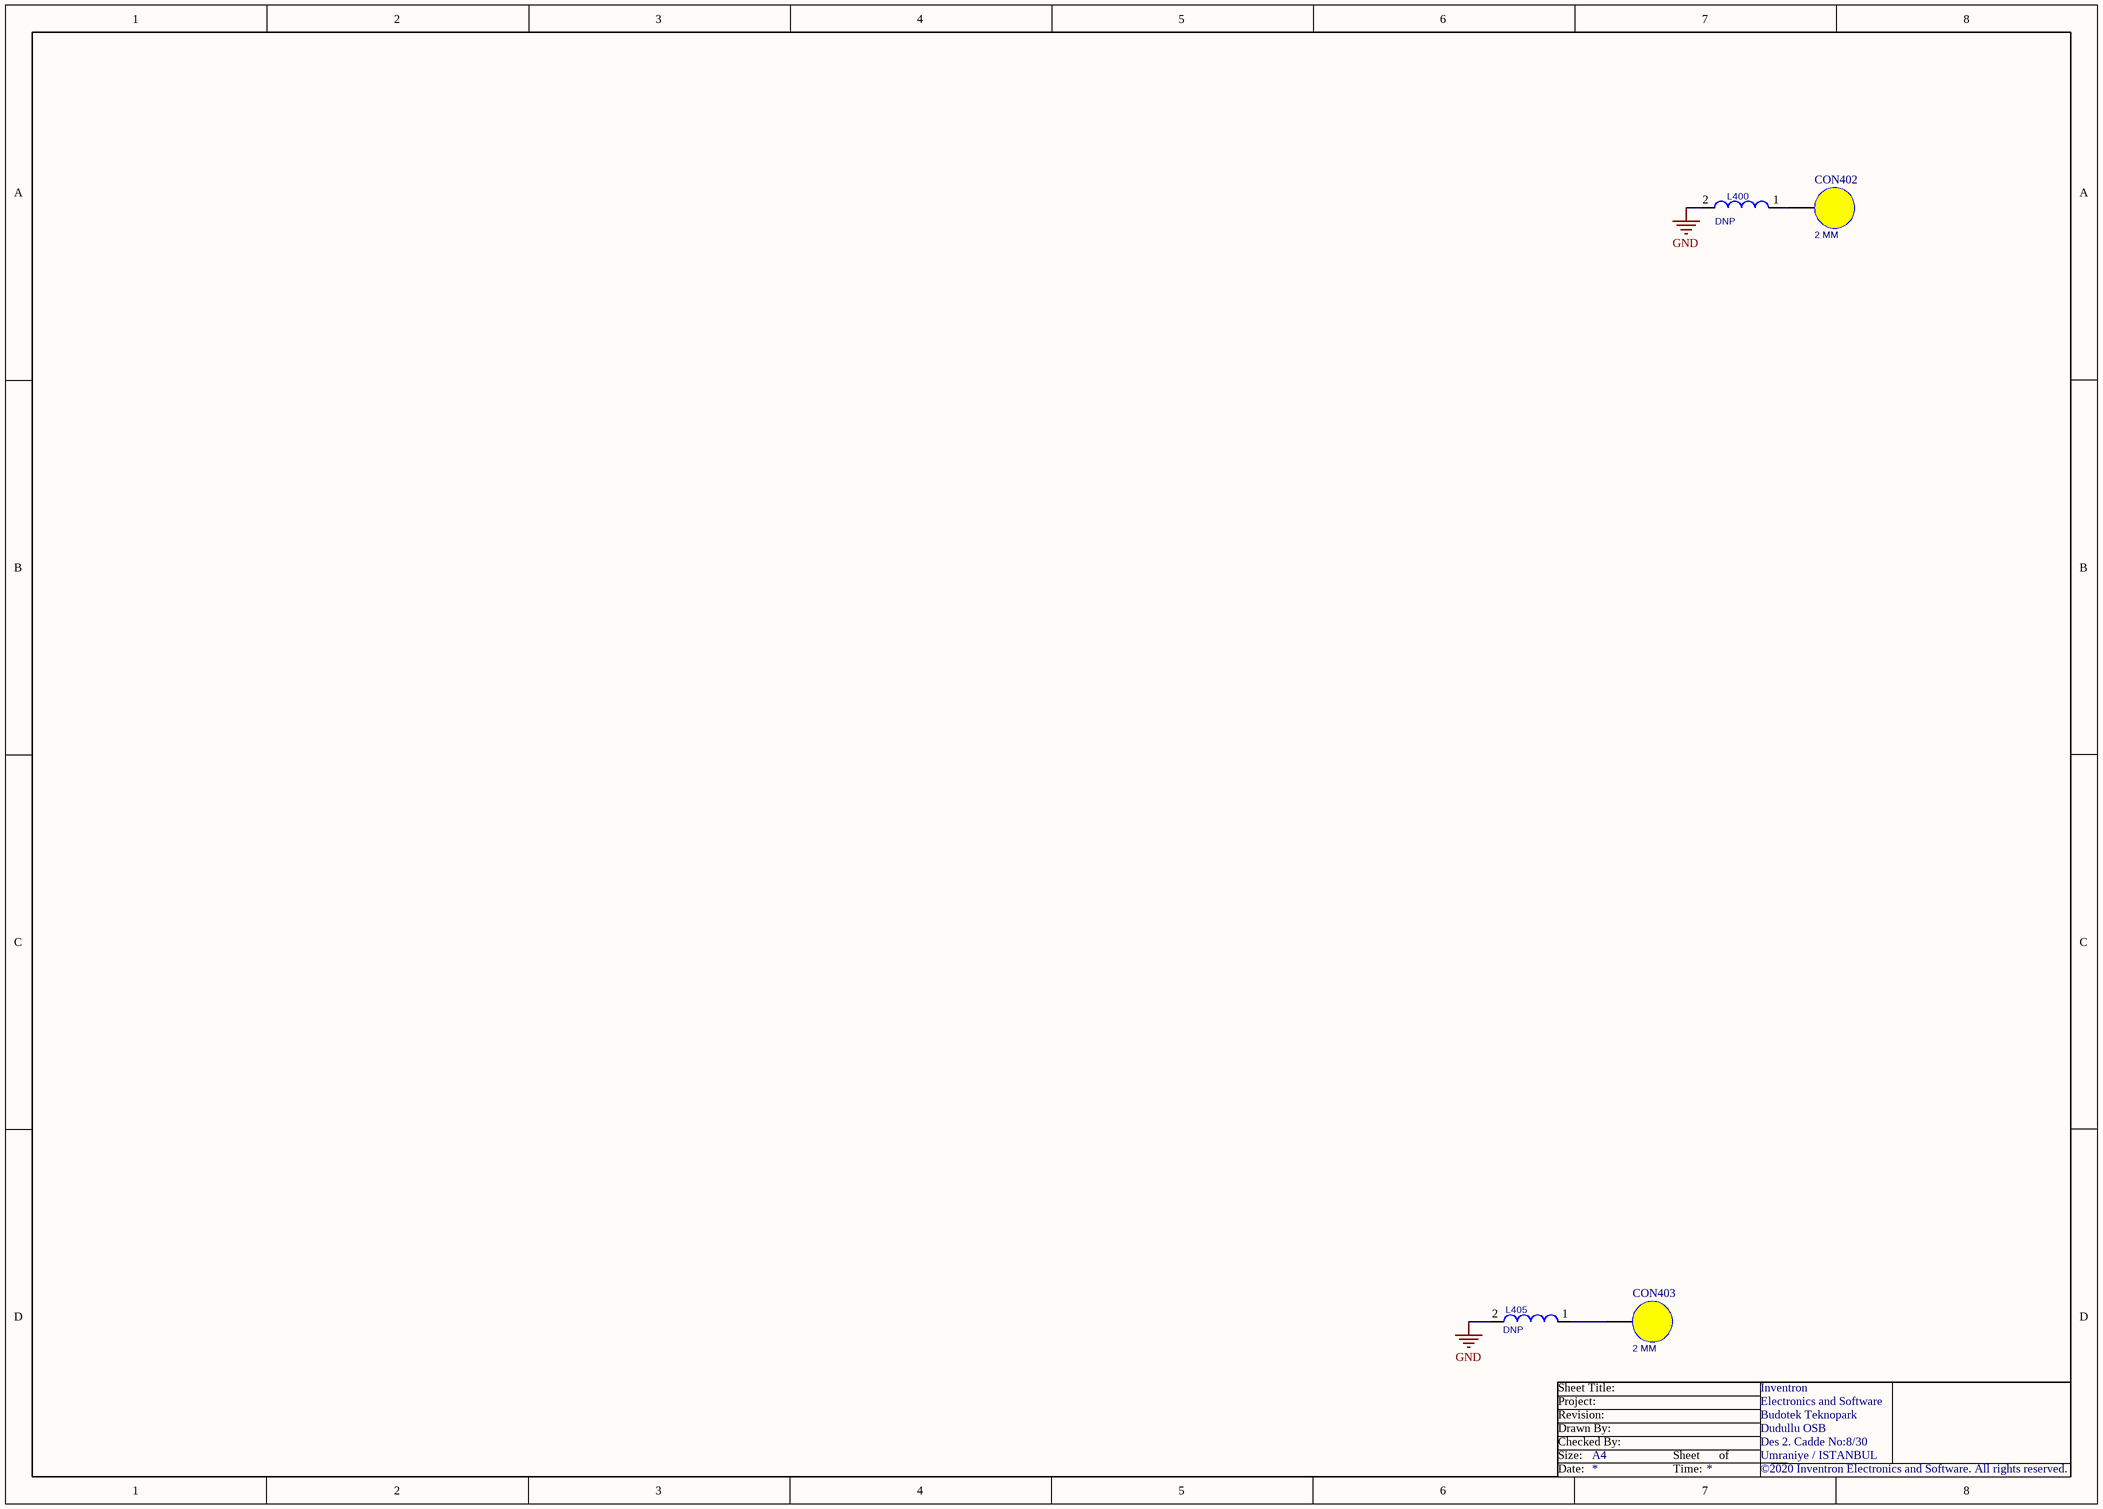
[diagram p5: 04 PCIe.SchDoc]

### Parts
CON402  2 MM  [9774045243R]
CON403  2 MM  [9774045243R]
L400  ASSY_OPT: DNP  [0603_RES]  (hidden comment: FERRITE 0603)
L405  ASSY_OPT: DNP  [0603_RES]  (hidden comment: FERRITE 0603)

### Nets
GND: L400.2 L405.2
NetCON402_1: CON402.1 L400.1
NetCON403_1: CON403.1 L405.1

### Notes on the sheet
- Sheet Title:
- Inventron
- Size:
- Drawn By:
- Revision:
- Project:
- Checked By:
- A4
- Sheet
- of
- Budotek Teknopark
- Dudullu OSB
- Des 2. Cadde No:8/30
- Umraniye / ISTANBUL
- Electronics and Software
- Date:
- Time:
- ©2020 Inventron Electronics and Software. All rights reserved.

### Library data of the parts
CON402 CON403 = CON-9774045243R: Round Standoff Threaded M2x0.4 Steel 0.177" (4.50mm); Manufacturer-1: Würth Elektronik; Class: Connector; Manufacturer Part Number-1: 9774045243R; Footprint: *; Manufacturer-2: *; Manufacturer Part Number-2: *; Inventron Stock No: *; Created By: EE; Created Date: *; Checked By: *; ASSY_OPT: *; Dimensions: *; Unit Price: 0.739; Revision Date/Note: *; Price Break: 100; Opt. Temp.: *; Features: *
L400 L405 = IND-FERRITE 0603: FERRITE BEAD 0603; Manufacturer Part Number-1: MPZ1608S260ATAH0; Manufacturer-1: TDK; Class: Inductor; Manufacturer-2: *; Inventron Stock No: *; Checked By: *; Dimensions: *; Revision Date/Note: *